# Altium schematic sheet Ollie_JoyStick.SchDoc
size B
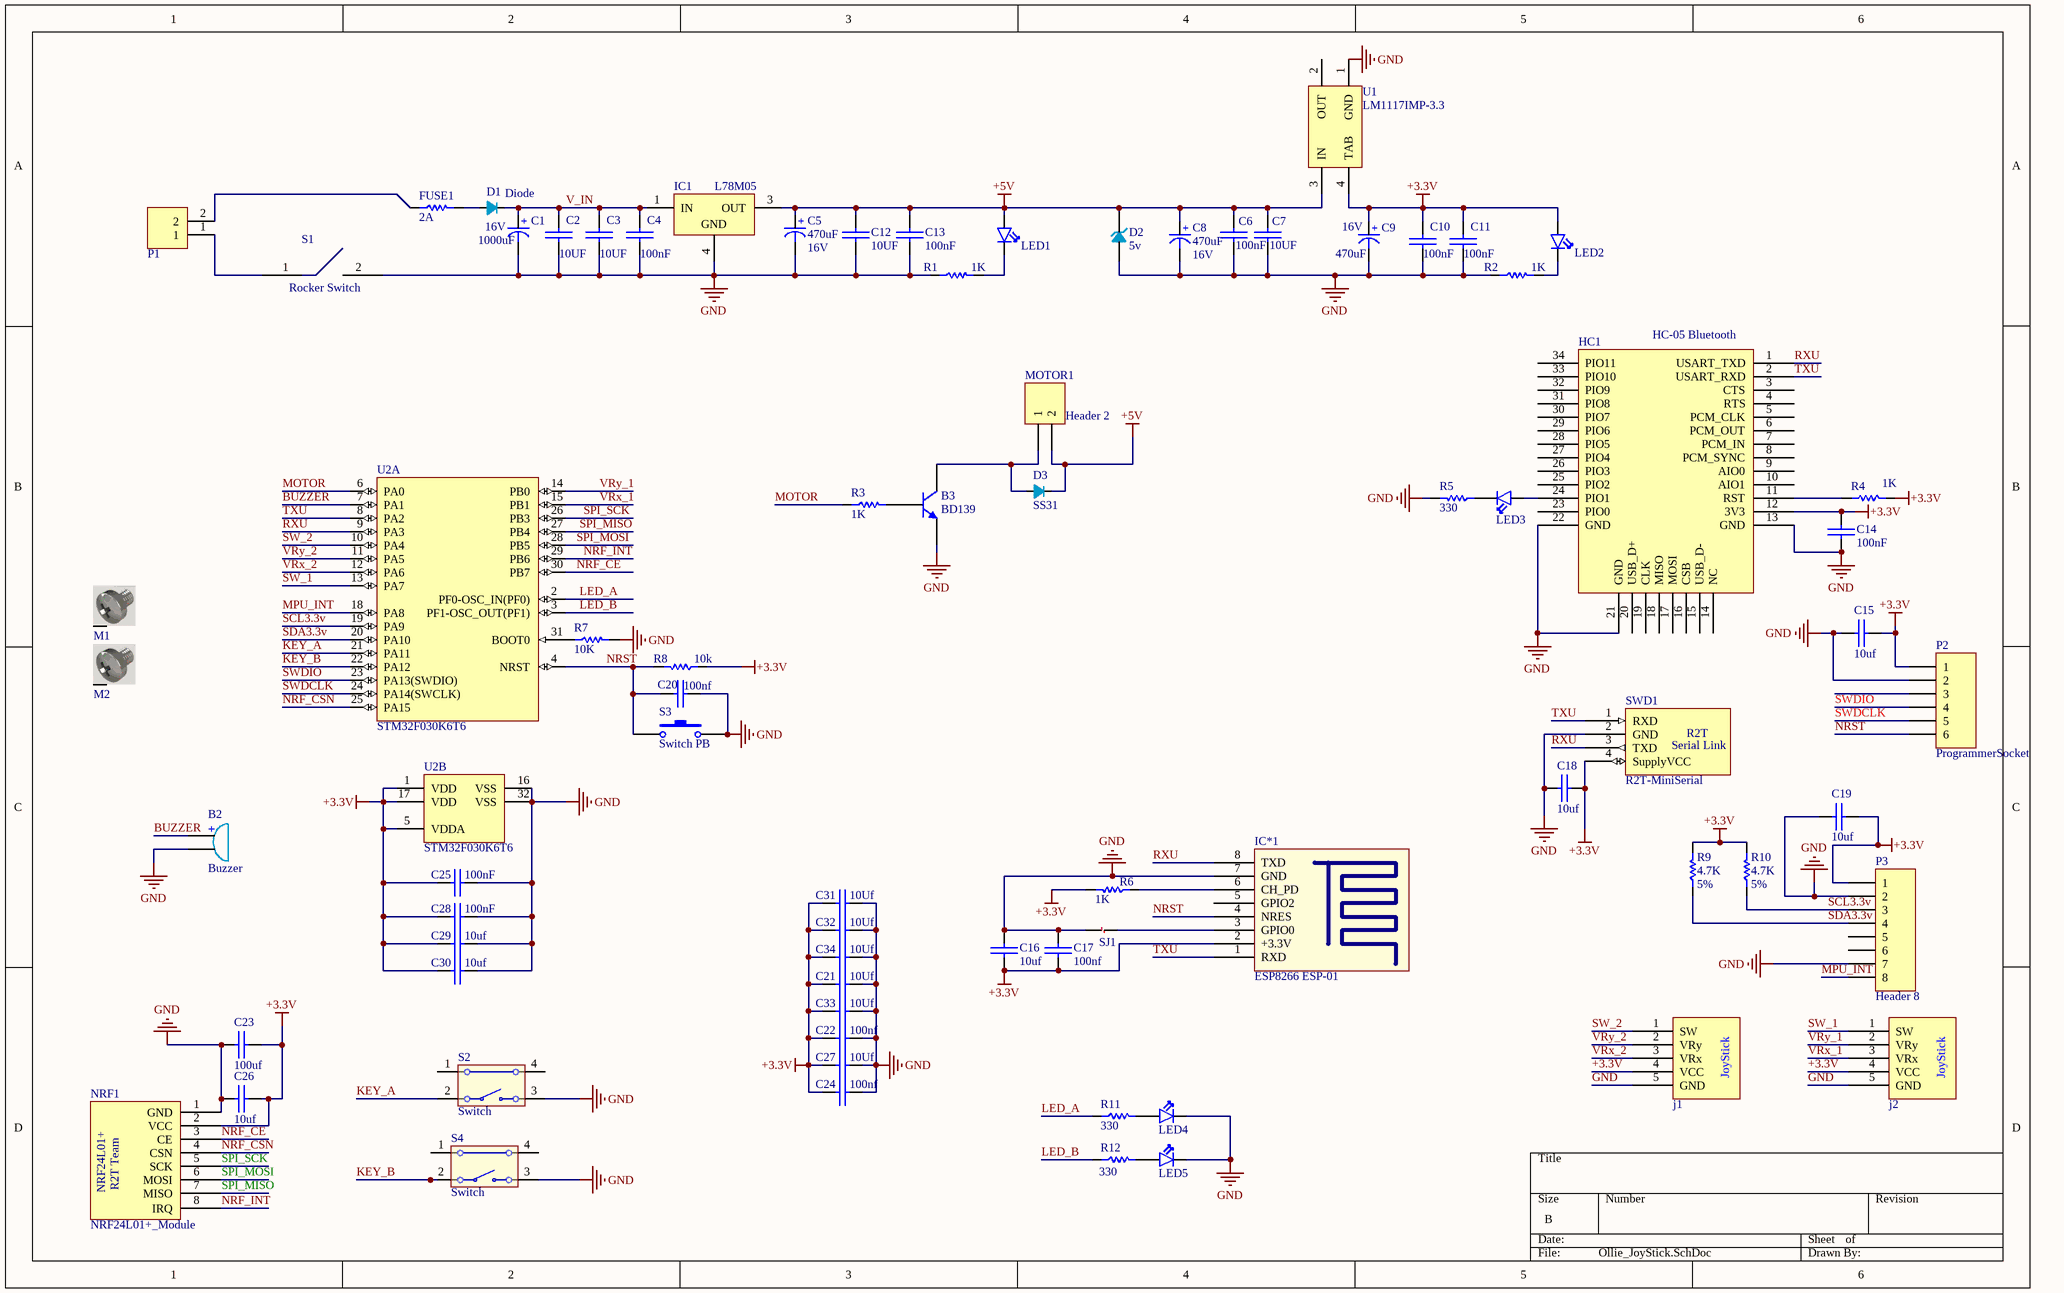
[diagram p0: Ollie_JoyStick.SchDoc]

## Parts
B2  Buzzer  [Buzzer]
B3  BD139  [BD139]
C1  Voltage: 16V  [cap 04]  (hidden comment: 1000uF)
C2  10UF  [SMD_CAP_1206]
C3  10UF  [SMD_CAP_1206]
C4  100nF  [SMD_CAP_1206]
C5  Voltage: 16V  [cap 03]  (hidden comment: 470uF)
C6  100nF  [SMD_CAP_1206]
C7  10UF  [SMD_CAP_1206]
C8  Voltage: 16V  [cap 03]  (hidden comment: 470uF)
C9  Voltage: 16V  [cap 03]  (hidden comment: 470uF)
C10  100nF  [SMD_CAP_1206]
C11  100nF  [SMD_CAP_1206]
C12  10UF  [SMD_CAP_1206]
C13  100nF  [SMD_CAP_1206]
C14  100nF  [SMD_CAP_1206]
C15  10uf  [SMD_CAP_0805]
C16  10uf  [SMD_CAP_0805]
C17  100nf  [SMD_CAP_0805]
C18  10uf  [SMD_CAP_1206]
C19  10uf  [SMD_CAP_1206]
C20  100nf  [SMD_CAP_0603]
C21  10Uf  [SMD_CAP_0805]
C22  100nf  [SMD_CAP_0805]
C23  100uf  [SMD_CAP_1206]
C24  100nf  [SMD_CAP_0805]
C25  100nF  [SMD_CAP_0805]
C26  10uf  [SMD_CAP_1206]
C27  10Uf  [SMD_CAP_0805]
C28  100nF  [SMD_CAP_0805]
C29  10uf  [SMD_CAP_0805]
C30  10uf  [SMD_CAP_0805]
C31  10Uf  [SMD_CAP_0805]
C32  10Uf  [SMD_CAP_0805]
C33  10Uf  [SMD_CAP_0805]
C34  10Uf  [SMD_CAP_0805]
D1  Description:: Diode  [DO-214AC ( SMD Diode )]  (hidden comment: SMD Diodes)
D2  5v  [DIOMELF3615N]
D3  Description:: SS31  [DO-214AC ( SMD Diode )]  (hidden comment: SMD Diodes)
FUSE1  2A  [RES 1206 (3216X08L)]
HC1  HC-05 Bluetooth  [HC-05]
IC1  L78M05  [TO-252]
IC*1  ESP8266 ESP-01  [ESP8266 ESP-01]
j1  joystick  [joystick]  (value not drawn)
j2  joystick  [joystick]  (value not drawn)
LED1  LED  [LED0805]  (value not drawn)
LED2  LED  [LED0805]  (value not drawn)
LED3  LED  [LED0805]  (value not drawn)
LED4  LED  [LED0805]  (value not drawn)
LED5  LED  [LED0805]  (value not drawn)
M1  Screw  [Board Screw]  (value not drawn)
M2  Screw  [Board Screw]  (value not drawn)
MOTOR1  Header 2  [HDR1X2]
NRF1  NRF24L01+_Module  [NRF24L01+_Module-LNA+PA]
P1  Connector  [Polarized Header 2]  (value not drawn)
P2  ProgrammerSocket  [HDR1X6]
P3  Header 8  [HDR1X8]
R1  1K  [RES 0805 (2012X06L)]
R2  1K  [RES 0805 (2012X06L)]
R3  1K  [RES 0805 (2012X06L)]
R4  1K  [RES 0805 (2012X06L)]
R5  330  [RES 0805 (2012X06L)]
R6  1K  [RES 1206 (3216X08L)]
R7  10K  [RES 0805 (2012X06L)]
R8  10k  [RES 0603 (1608X06L)]
R9  Tolerance: 5%  [RES 0805 (2012X06L)]  (hidden comment: 4.7K)
R10  Tolerance: 5%  [RES 0805 (2012X06L)]  (hidden comment: 4.7K)
R11  330  [RES 0805 (2012X06L)]
R12  330  [RES 0805 (2012X06L)]
S1  Rocker Switch  [Rocker Switch mini]
S2  Switch  [4312560387x6]
S3  Switch PB  [SW-PB]
S4  Switch  [4312560387x6]
SJ1  SmdJumper  [SMD Jumper]  (value not drawn)
SWD1  R2T-MiniSerial  [SerialWireMini]
U1  LM1117IMP-3.3  [MP04A_N]
U2  STM32F030K6T6  [STM-LQFP32_N]  (parts A,B of 2)

## Nets
+3.3V: C9.1(+) C10.1(+) C11.1(+) C14.2(-) C15.1(+) C16.1(+) C17.1(+) C18.1(+) C19.2(-) C21.2(-) C22.2(-) C23.2(-) C24.2(-) C25.2(-) C26.2(-) C27.2(-) C28.2(-) C29.1(+) C30.1(+) C31.2(-) C32.2(-) C33.2(-) C34.2(-) HC1.12(3V3) IC*1.2(+3.3V) j1.4(VCC) j2.4(VCC) LED2.1(A) NRF1.2(VCC) P2.1 P3.1 R4.1 R6.2 R8.1 R9.2 R10.2 SWD1.4(SupplyVCC) U1.4(TAB) U2.1(VDD) U2.5(VDDA) U2.17(VDD)
+5V: C5.1(+) C6.1(+) C7.1(+) C8.1(+) C12.1(+) C13.1(+) D2.1 D3.1 IC1.3(OUT) LED1.1(A) MOTOR1.2 U1.3(IN)
GND: B2.2(GND) B3.E C1.2(-) C2.2(-) C3.2(-) C4.2(-) C5.2(-) C6.2(-) C7.2(-) C8.2(-) C9.2(-) C10.2(-) C11.2(-) C12.2(-) C13.2(-) C14.1(+) C15.2(-) C16.2(-) C17.2(-) C18.2(-) C19.1(+) C20.1(+) C21.1(+) C22.1(+) C23.1(+) C24.1(+) C25.1(+) C26.1(+) C27.1(+) C28.1(+) C29.2(-) C30.2(-) C31.1(+) C32.1(+) C33.1(+) C34.1(+) D2.2 HC1.13(GND) HC1.21(GND) HC1.22(GND) IC1.4(GND) IC*1.7(GND) j1.5(GND) j2.5(GND) LED4.2(K) LED5.2(K) NRF1.1(GND) P2.2 P3.2 P3.7 R1.1 R2.1 R5.2 R7.2 S1.2 S2.3 S3.2 S4.3 SJ1.1 SWD1.2(GND) U1.1(GND) U2.16(VSS) U2.32(VSS)
BUZZER: B2.1(VCC) U2.7(PA1)
KEY_A: S2.2 U2.21(PA11)
KEY_B: S4.2 U2.22(PA12)
LED_A: R11.1 U2.2(PF0-OSC_IN(PF0))
LED_B: R12.1 U2.3(PF1-OSC_OUT(PF1))
MOTOR: R3.1 U2.6(PA0)
MPU_INT: P3.8 U2.18(PA8)
NRF_CE: NRF1.3(CE) U2.30(PB7)
NRF_CSN: NRF1.4(CSN) U2.25(PA15)
NRF_INT: NRF1.8(IRQ) U2.29(PB6)
NRST: C20.2(-) IC*1.4(NRES) P2.6 R8.2 S3.1 U2.4(NRST)
RXU: HC1.1(USART_TXD) IC*1.8(TXD) SWD1.3(TXD) U2.9(PA3)
SCL3.3v: P3.3 R10.1 U2.19(PA9)
SDA3.3v: P3.4 R9.1 U2.20(PA10)
SPI_MISO: NRF1.7(MISO) U2.27(PB4)
SPI_MOSI: NRF1.6(MOSI) U2.28(PB5)
SPI_SCK: NRF1.5(SCK) U2.26(PB3)
SW_1: j2.1(SW) U2.13(PA7)
SW_2: j1.1(SW) U2.10(PA4)
SWDCLK: P2.5 U2.24(PA14(SWCLK))
SWDIO: P2.4 U2.23(PA13(SWDIO))
TXU: HC1.2(USART_RXD) IC*1.1(RXD) SWD1.1(RXD) U2.8(PA2)
V_IN: C1.1(+) C2.1(+) C3.1(+) C4.1(+) D1.1 IC1.1(IN)
VRx_1: j2.3(VRx) U2.15(PB1)
VRx_2: j1.3(VRx) U2.12(PA6)
VRy_1: j2.2(VRy) U2.14(PB0)
VRy_2: j1.2(VRy) U2.11(PA5)
NetB3_B: B3.B R3.2
NetB3_C: B3.C D3.0 MOTOR1.1
NetD1_0: D1.0 FUSE1.2
NetFUSE1_1: FUSE1.1 P1.2
NetHC1_11: HC1.11(RST) R4.2
NetHC1_24: HC1.24(PIO1) LED3.1(A)
NetIC*1_3: IC*1.3(GPIO0) SJ1.2
NetIC*1_6: IC*1.6(CH_PD) R6.1
NetLED1_2: LED1.2(K) R1.2
NetLED2_2: LED2.2(K) R2.2
NetLED3_2: LED3.2(K) R5.1
NetLED4_1: LED4.1(A) R11.2
NetLED5_1: LED5.1(A) R12.2
NetP1_1: P1.1 S1.1
NetR7_1: R7.1 U2.31(BOOT0)

Not connected (* = marked no-connect by the designer): HC1 3(CTS) 4(RTS) 5(PCM_CLK) 6(PCM_OUT) 7(PCM_IN) 8(PCM_SYNC) 9(AIO0) 10(AIO1) 14(NC) 15(USB_D-) 16(CSB) 17(MOSI) 18(MISO) 19(CLK) 20(USB_D+) 23(PIO0) 25(PIO2) 26(PIO3) 27(PIO4) 28(PIO5) 29(PIO6) 30(PIO7) 31(PIO8) 32(PIO9) 33(PIO10) 34(PIO11); IC*1 5(GPIO2); M1 S; M2 S; P2 3; P3 5 6; S2 1 4; S4 1 4; U1 2(OUT)

## Notes on the sheet
- (in symbol Buzzer) +
- (in symbol joystick) JoyStick
- (in symbol NRF24L01+_Module) NRF24L01+; R2T Team
- (in symbol R2T-MiniSerial) R2T; Serial Link

## Library data of the parts
B2 = Buzzer: Designer: Hamed Jafarzadeh
B3 = BD139: BJT
C1 C5 C8 C9 = Cap-Polar: Polar Capacitor; Designer: Saeid Jorablo; Organazation: ControTec; Adding Date: 1387/12/20
  C1: Value: 1000uF
  C5 C8 C9: Value: 470uF
C2-C4 C6 C7 C10-C34 = Cap-Bipolar: Bipolar Capacitor; Voltage: 100V; Designer: Saeid Jorablo; Organazation: ControTec; Adding Date: 1387/12/20
  C2 C3 C7 C12: Value: 10UF
  C4 C6 C10 C11 C13 C14 C25 C28: Value: 100nF
  C15 C16 C18 C19 C26 C29 C30: Value: 10uf
  C17 C20 C22 C24: Value: 100nf
  C21 C27 C31-C34: Value: 10Uf
  C23: Value: 100uf
D1 D3 = SMD Diodes: Designer :: Hamed Jafarzadeh
D2 = Diode Zener SMD: Designer: Hamed Jafarzadeh
FUSE1 R6 R9 R10 = Resistor
  FUSE1: Value: 2A
  R6: Value: 1K
  R9 R10: Value: 4.7K
IC1 = L78M05: Precision 500mA Regulator
LED1-LED5 = LED: Designer :: Razi Research Team Of Mashhad - Hamed Jafarzadeh
M1 M2 = Board Screw: Board Screw With Spacer
MOTOR1 = Header 2: Header, 2-Pin; LatestRevisionDate: 17-Jul-2002; LatestRevisionNote: Re-released for DXP Platform.; Publisher: Altium Limited
NRF1 = NRF24L01+_Module: Designer:: HamedJafarzadeh
P1 = Connector 2Pin: Designer:: Hamed Jafarzadeh - www.R2T.ir
P2 = Header 6: Header, 6-Pin; LatestRevisionDate: 17-Jul-2002; LatestRevisionNote: Re-released for DXP Platform.; Publisher: Altium Limited
P3 = Header 8: Header, 8-Pin; LatestRevisionDate: 17-Jul-2002; LatestRevisionNote: Re-released for DXP Platform.; Publisher: Altium Limited
R1-R5 R7 R11 R12 = Resistor: Tolerance: 5%; Power: 1/8 W
  R1-R4: Value: 1K
  R5 R11 R12: Value: 330
  R7: Value: 10K
R8 = Resistor: Tolerance: 1%; Power: 1/8 W; Value: 10k
S2 S4 = WS-TATU, 431256038736: switch right angel; Manufacturer: Wurth Elektronik; partNo: 431256038736; ComponentLink1Description: Manufacturer; ComponentLink1URL: http://www.we-online.de; Created by: Baojun Chen; Created Date: Dec.2015; ComponentLink2Description: Datasheet; ComponentLink2URL: http://katalog.we-online.de/em/datasheet/4312x6xxx7x6.pdf
S3 = Switch PB: Push Button Switch
U1 = LM1117IMP-x.x: 3.3 Volt, 800mA Low-Dropout Linear Regulator; Manufacturer: National Semiconductor; PackageTopMarking: XYTT*N05B; PowerWise: N; CompType: LDO IC; Published: 4-Dec-2008; DatasheetVersion: Apr-2006; PackageVersion: revB, Apr-2003; PackageReference: MP04A; Publisher: Altium Limited; PackageDescription: Molded SOT-223, 6.50 x 3.56 x 1.6mm Body, 4 Lead, 2.3mm Pitch; Supplier 1: Farnell; Supplier Part Number 1: 7614123; PartNumber: LM1117IMP-3.3; RoHS: N; PinCount: 4; Code_JEDEC: TO-261-AA; Code_IPC: SOT223-4; ComponentLink1Description: LM1117 Datasheet; ComponentLink1URL: http://www.national.com/ds/LM/LM1117.pdf; ComponentLink2Description: LM1117 Web Page; ComponentLink2URL: http://www.national.com/pf/LM/LM1117.html; ComponentLink3Description: MP04A Package Page; ComponentLink3URL: http://www.national.com/packaging/folders/mp04a.html
U2 = STM32F030K6T6: ARM Cortex-M0 32-bit MCU, 32 KB Flash, 4 KB Internal RAM, 26 I/Os, 32-pin LQFP, -40 to 85 degC, Tray; FLASH Size (Prog) (kB): 32; I/Os (High Current): 26; Internal RAM Size (kB): 4; Operating Frequency(F) (Processor speed) (MHz): 48; Supply Voltage(Vcc) min (V): 2.4; DatasheetVersion: Rev. 1; PackageVersion: Rev. 1, 07/2013; PackageReference: LQFP32; PackageDescription: 32-Pin Low Profile Quad Flat Package, 7 x 7 mm Body, 0.8 mm Pitch; Supplier 1: Digi-Key; Supplier Part Number 1: 497-14046-ND; Supplier 2: Newark; Supplier Part Number 2: 19X6194; Supplier 3: Mouser; Supplier Part Number 3: 511-STM32F030K6T6; Core: ARM Cortex-M0; Packing: Tray; Mounting Technology: Surface Mount; PartNumber: STM32F030K6T6; ComponentLink1Description: Manufacturer URL; ComponentLink1URL: http://www.st.com/web/en/home.html; ComponentLink2Description: Datasheet; ComponentLink2URL: http://www.st.com/st-web-ui/static/active/en/resource/technical/document/datasheet/DM00088500.pdf; ComponentLink3Description: Package Specification; ComponentLink3URL: http://www.st.com/st-web-ui/static/active/en/resource/technical/document/datasheet/DM00088500.pdf